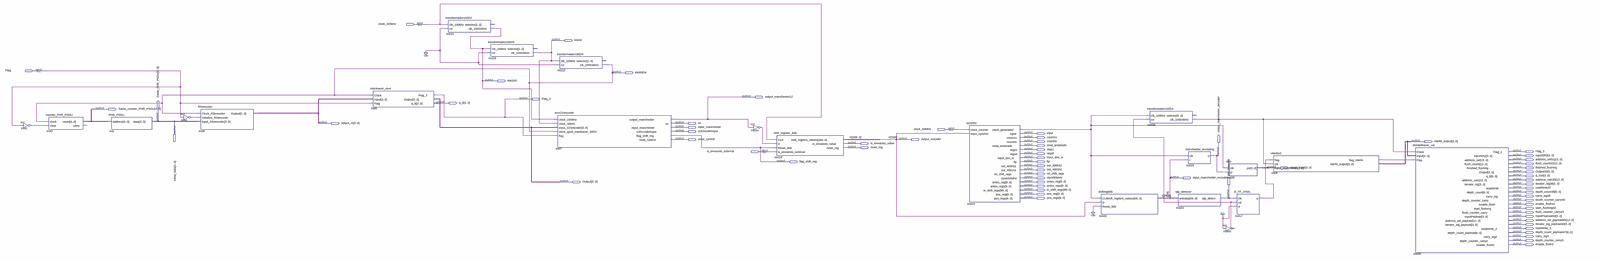
[diagram p0: schematic sheet, whole]
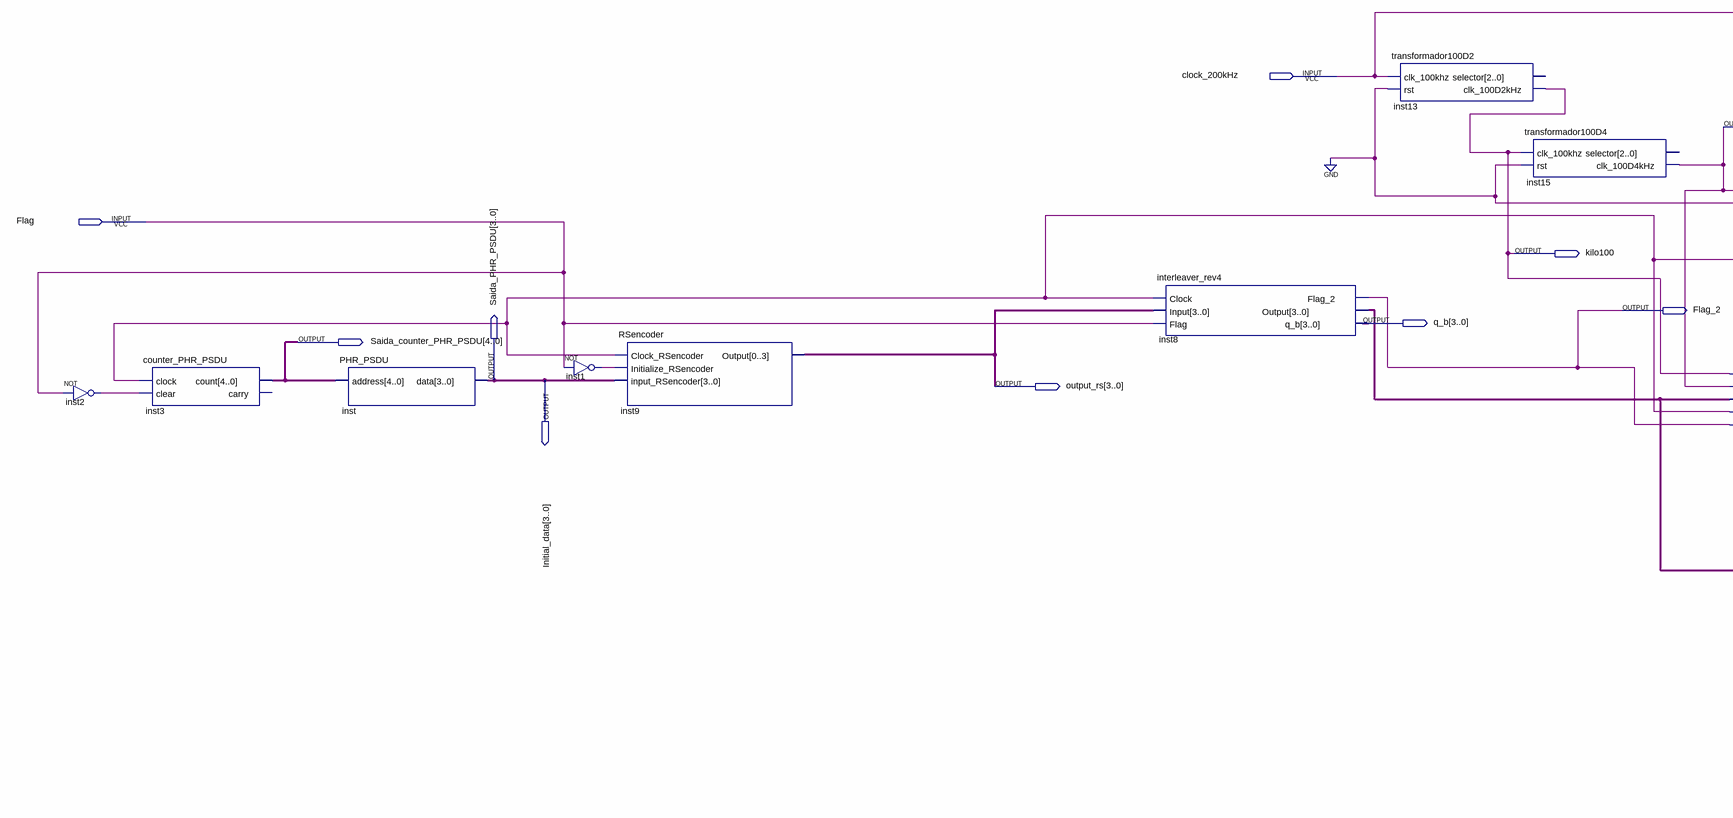
[diagram p1: schematic sheet, left part]
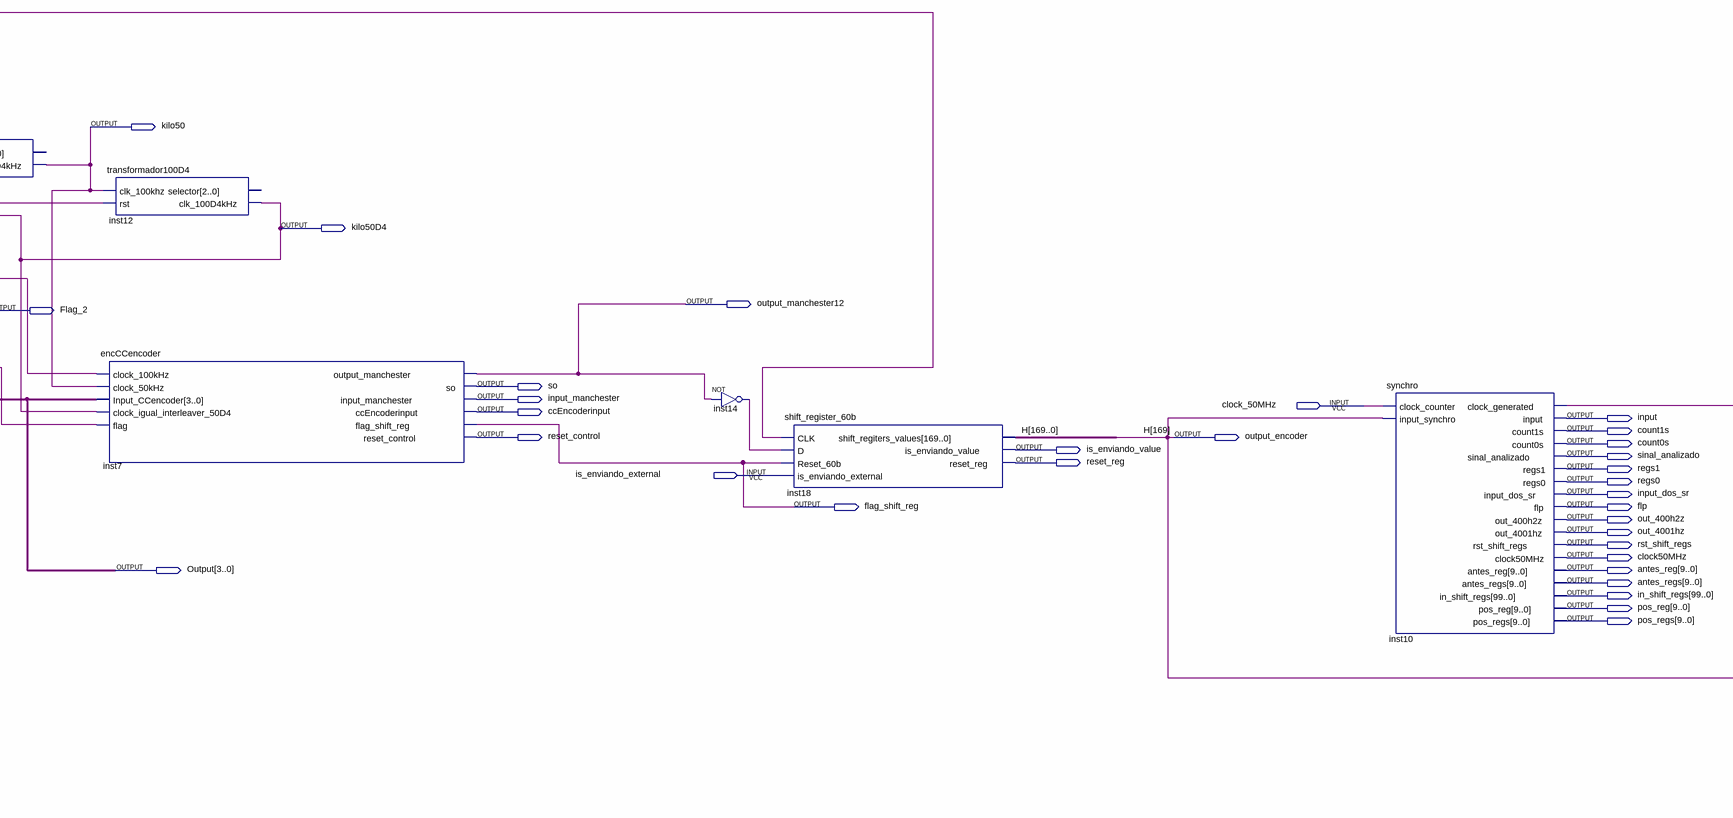
[diagram p2: schematic sheet, centre part]
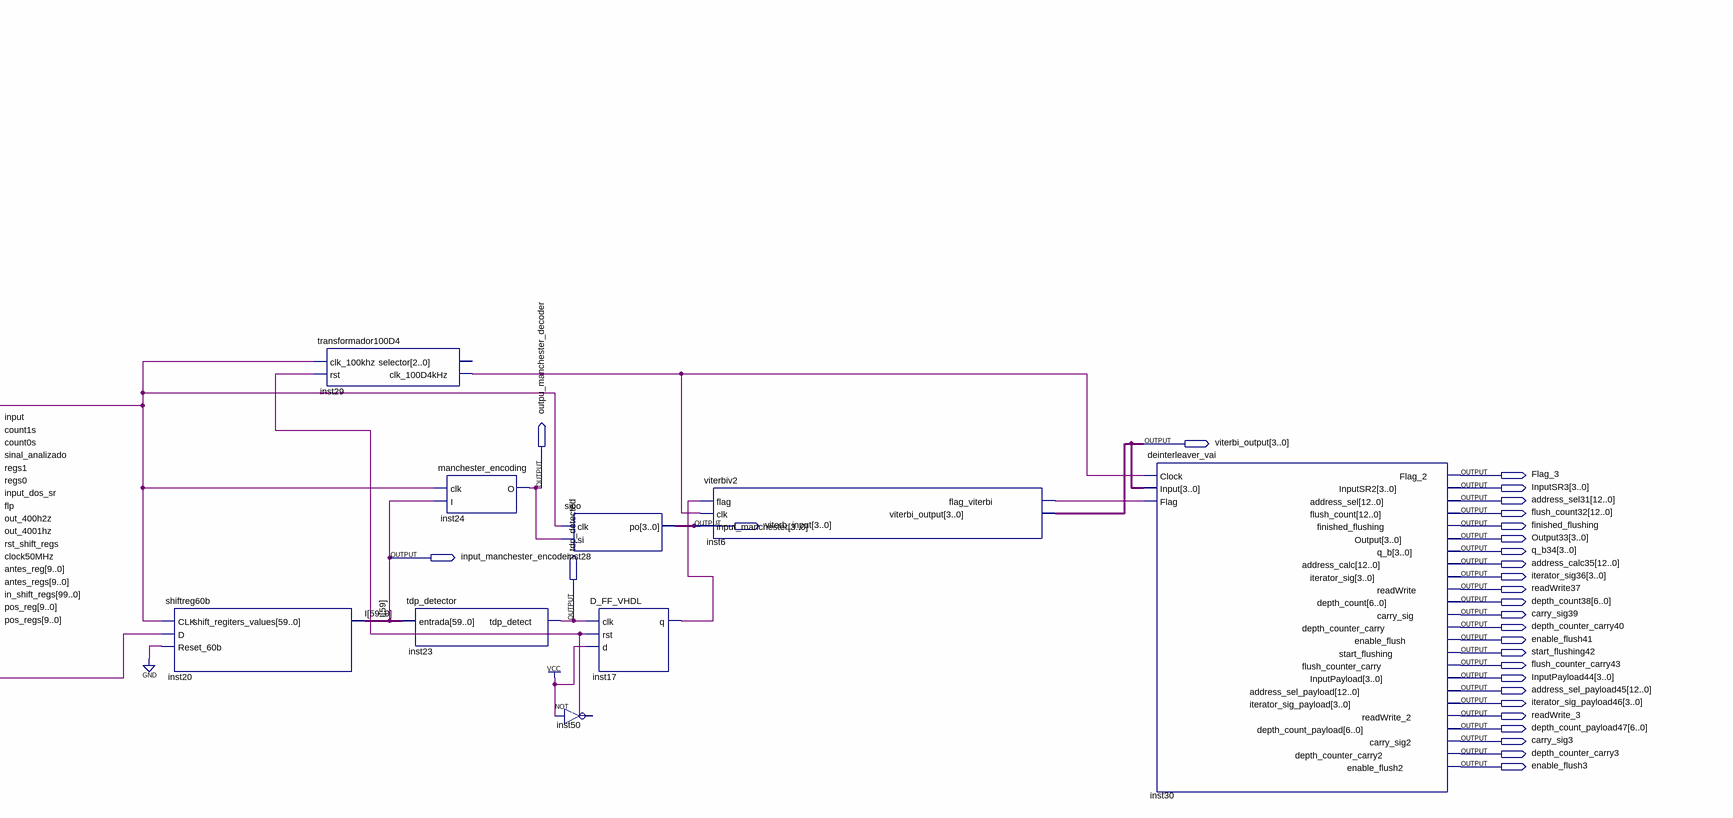
[diagram p3: schematic sheet, right part]
// Quartus schematic EncIntegration2.bdf as structural Verilog: 22 symbols, 69 pins
module EncIntegration2 (
  input  clock_200kHz,
  input  Flag,
  input  clock_50MHz,
  input  is_enviando_external,
  output kilo50,
  output kilo50D4,
  output kilo100,
  output output_manchester12,
  output Flag_2,
  output [3:0] q_b,
  output [4:0] Saida_counter_PHR_PSDU,
  output [3:0] Saida_PHR_PSDU,
  output [3:0] Initial_data,
  output [3:0] output_rs,
  output so,
  output input_manchester,
  output ccEncoderinput,
  output \input ,
  output count1s,
  output reset_control,
  output output_encoder,
  output count0s,
  output [3:0] viterbi_output,
  output is_enviando_value,
  output sinal_analizado,
  output reset_reg,
  output regs1,
  output Flag_3,
  output regs0,
  output outpu_manchester_decoder,
  output [3:0] InputSR3,
  output input_dos_sr,
  output [12:0] address_sel31,
  output flag_shift_reg,
  output flp,
  output [12:0] flush_count32,
  output out_400h2z,
  output [3:0] viterb_input,
  output finished_flushing,
  output out_4001hz,
  output [3:0] Output33,
  output rst_shift_regs,
  output [3:0] q_b34,
  output clock50MHz,
  output input_manchester_encoder,
  output [12:0] address_calc35,
  output [3:0] Output,
  output [9:0] antes_reg,
  output [3:0] iterator_sig36,
  output [9:0] antes_regs,
  output readWrite37,
  output [99:0] in_shift_regs,
  output [6:0] depth_count38,
  output [9:0] pos_reg,
  output carry_sig39,
  output [9:0] pos_regs,
  output tdp_detected,
  output depth_counter_carry40,
  output enable_flush41,
  output start_flushing42,
  output flush_counter_carry43,
  output [3:0] InputPayload44,
  output [12:0] address_sel_payload45,
  output [3:0] iterator_sig_payload46,
  output readWrite_3,
  output [6:0] depth_count_payload47,
  output carry_sig3,
  output depth_counter_carry3,
  output enable_flush3
);

  wire inst1_out, inst2_out, inst6_flag_viterbi, inst10_clock_generated, inst14_out, inst17_q,
       inst29_clk_100d4khz, inst50_out;
  wire [58:0] I;
  wire [168:0] H;

  not inst2 (inst2_out, Flag);
  counter_PHR_PSDU inst3 (.clock(kilo50D4), .clear(inst2_out), .count(Saida_counter_PHR_PSDU));  // open: carry
  PHR_PSDU inst (.address(Saida_counter_PHR_PSDU), .data(Initial_data));
  not inst1 (inst1_out, Flag);
  RSencoder inst9 (
    .Clock_RSencoder(kilo50D4), .Initialize_RSencoder(inst1_out), .input_RSencoder(Initial_data),
    .Output(output_rs));
  interleaver_rev4 inst8 (
    .Clock(kilo50D4), .Input(output_rs), .Flag(Flag), .Flag_2(Flag_2), .Output(Output), .q_b(q_b));
  transformador100D2 inst13 (.clk_100khz(clock_200kHz), .rst(1'b0), .clk_100D2kHz(kilo100));  // open: selector
  transformador100D4 inst15 (.clk_100khz(kilo100), .rst(1'b0), .clk_100D4kHz(kilo50));  // open: selector
  transformador100D4 inst12 (.clk_100khz(kilo50), .rst(1'b0), .clk_100D4kHz(kilo50D4));  // open: selector
  encCCencoder inst7 (
    .clock_100kHz(kilo100), .clock_50kHz(kilo50), .Input_CCencoder(Output),
    .clock_igual_interleaver_50D4(kilo50D4), .flag(Flag_2), .output_manchester(output_manchester12), .so(so),
    .input_manchester(input_manchester), .ccEncoderinput(ccEncoderinput), .flag_shift_reg(flag_shift_reg),
    .reset_control(reset_control));
  not inst14 (inst14_out, output_manchester12);
  shift_register_60b inst18 (
    .CLK(clock_200kHz), .D(inst14_out), .Reset_60b(flag_shift_reg),
    .is_enviando_external(is_enviando_external), .shift_regiters_values({output_encoder, H}),
    .is_enviando_value(is_enviando_value), .reset_reg(reset_reg));
  synchro inst10 (
    .clock_counter(clock_50MHz), .input_synchro(output_encoder), .clock_generated(inst10_clock_generated),
    .\input (\input ), .count1s(count1s), .count0s(count0s), .sinal_analizado(sinal_analizado),
    .regs1(regs1), .regs0(regs0), .input_dos_sr(input_dos_sr), .flp(flp), .out_400h2z(out_400h2z),
    .out_4001hz(out_4001hz), .rst_shift_regs(rst_shift_regs), .clock50MHz(clock50MHz), .antes_reg(antes_reg),
    .antes_regs(antes_regs), .in_shift_regs(in_shift_regs), .pos_reg(pos_reg), .pos_regs(pos_regs));
  shiftreg60b inst20 (
    .CLK(inst10_clock_generated), .D(output_encoder), .Reset_60b(1'b0),
    .shift_regiters_values({input_manchester_encoder, I}));
  transformador100D4 inst29 (
    .clk_100khz(inst10_clock_generated), .rst(inst50_out), .clk_100D4kHz(inst29_clk_100d4khz));  // open: selector
  tdp_detector inst23 (.entrada({input_manchester_encoder, I}), .tdp_detect(tdp_detected));
  manchester_encoding inst24 (.clk(inst10_clock_generated), .I(input_manchester_encoder), .O(outpu_manchester_decoder));
  sipo inst28 (.clk(inst10_clock_generated), .si(outpu_manchester_decoder), .po(viterb_input));
  not inst50 (inst50_out, 1'b1);
  D_FF_VHDL inst17 (.clk(tdp_detected), .rst(inst50_out), .d(1'b1), .q(inst17_q));
  viterbiv2 inst6 (
    .flag(inst17_q), .clk(inst29_clk_100d4khz), .input_manchester(viterb_input),
    .flag_viterbi(inst6_flag_viterbi), .viterbi_output(viterbi_output));
  deinterleaver_vai inst30 (
    .Clock(inst29_clk_100d4khz), .Input(viterbi_output), .Flag(inst6_flag_viterbi), .Flag_2(Flag_3),
    .InputSR2(InputSR3), .address_sel(address_sel31), .flush_count(flush_count32),
    .finished_flushing(finished_flushing), .Output(Output33), .q_b(q_b34), .address_calc(address_calc35),
    .iterator_sig(iterator_sig36), .readWrite(readWrite37), .depth_count(depth_count38),
    .carry_sig(carry_sig39), .depth_counter_carry(depth_counter_carry40), .enable_flush(enable_flush41),
    .start_flushing(start_flushing42), .flush_counter_carry(flush_counter_carry43),
    .InputPayload(InputPayload44), .address_sel_payload(address_sel_payload45),
    .iterator_sig_payload(iterator_sig_payload46), .readWrite_2(readWrite_3),
    .depth_count_payload(depth_count_payload47), .carry_sig2(carry_sig3),
    .depth_counter_carry2(depth_counter_carry3), .enable_flush2(enable_flush3));

  assign Saida_PHR_PSDU = Initial_data;

  // Other names for the same wires on the sheet: H[169] = output_encoder; I[59] = input_manchester_encoder
endmodule
